# EAGLE schematic BPM (EAGLE 8.1.0)

## Sheet 1 of 5
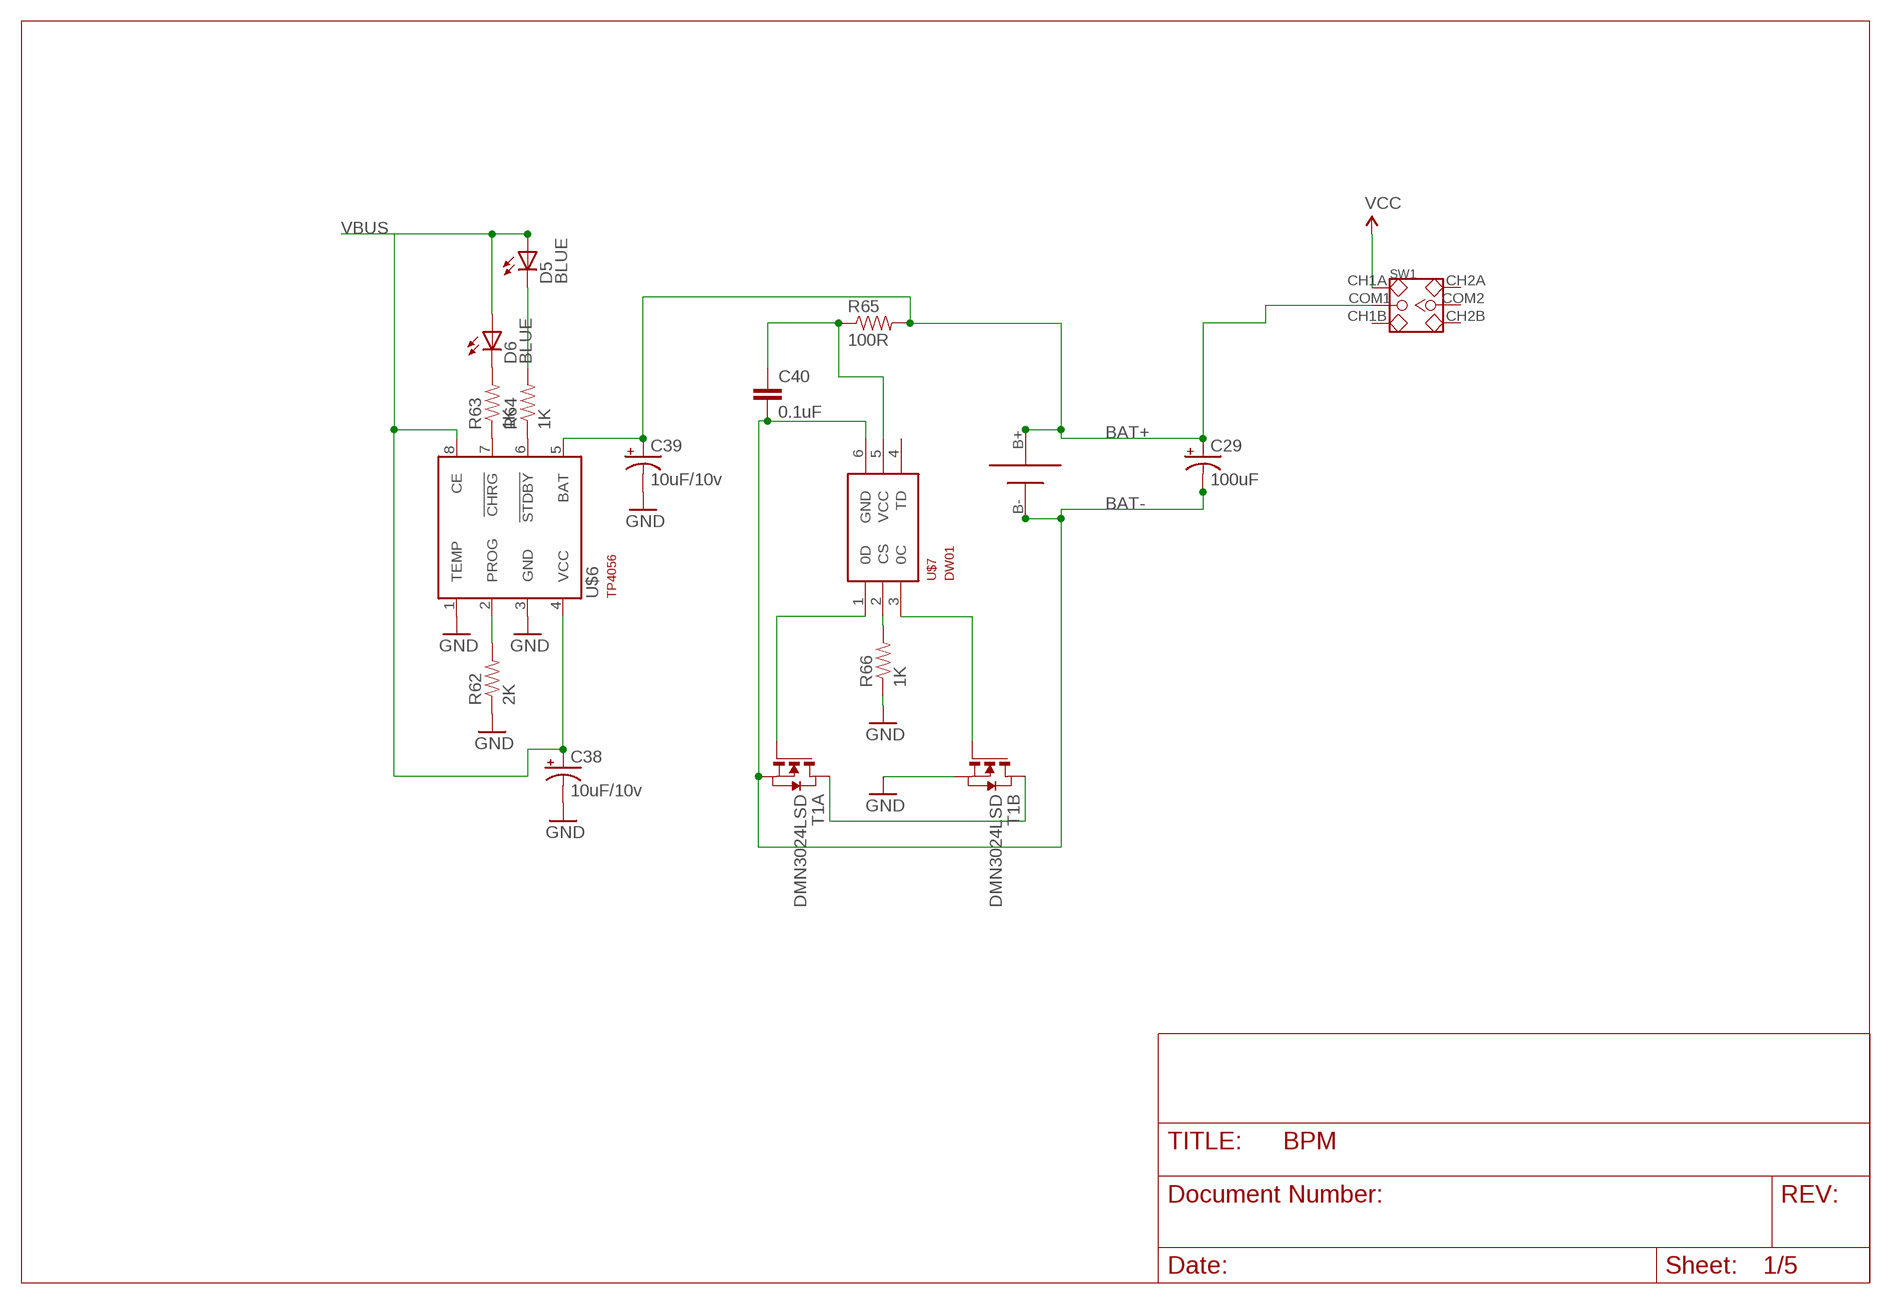
[diagram p0: schematic, sheet 1]

### Parts
C29  100uF  CAP_POLF80  [NIPPON_F80]
C38  10uF/10v  CAP_POL1206-KIT  [EIA3216-KIT]
C39  10uF/10v  CAP_POL1206-KIT  [EIA3216-KIT]
C40  0.1uF  0.1UF-100V-10%(0603)  [0603-CAP]
D5  BLUE  LED-BLUE0603  [LED-0603]
D6  BLUE  LED-BLUE0603  [LED-0603]
R62  2K  1KOHM1/10W1%(0603)  [0603-RES]
R63  1K  1KOHM1/10W1%(0603)  [0603-RES]
R64  1K  1KOHM1/10W1%(0603)  [0603-RES]
R65  100R  1KOHM1/10W1%(0603)  [0603-RES]
R66  1K  1KOHM1/10W1%(0603)  [0603-RES]
SW1  SMD-TOGGLE-SWITCH-2CH(2X3P-7X3.5MM)  [SW6-2.54-SMD-7.0X3.5X1.5MM]
T1  DMN3024LSD  [TSSOP-8]
U$4  18650SMD  [18650SMD]
U$6  TP4056  [SOT23-8]
U$7  DW01  [SOT23-6]

### Nets
BAT+: C29.+ C39.A(+) R65.2 SW1.COM1 U$4.B+ U$6.5(BAT) ; also sheet 4
BAT-: C29.- C40.2 T1.2(A:S) T1.3(A:S) U$4.B- U$7.6(GND) ; also sheet 4
GND: C38.C(-) C39.C(-) R62.1 R66.1 T1.6(B:S) T1.7(B:S) U$6.1(TEMP) U$6.3(GND) ; also sheet 2,3,4,5
N$58: R62.2 U$6.2(PROG)
N$59: R63.1 U$6.7(!CHRG)
N$60: R64.1 U$6.6(!STDBY)
N$61: D6.C R63.2
N$62: D5.C R64.2
N$65: C40.1 R65.1 U$7.5(VCC)
N$67: T1.4(A:G) U$7.1(0D)
N$68: R66.2 U$7.2(CS)
N$69: T1.1(A:D) T1.8(B:D)
N$70: T1.5(B:G) U$7.3(0C)
VBUS: C38.A(+) D5.A D6.A U$6.4(VCC) U$6.8(CE) ; also sheet 2
VCC: SW1.CH1A ; also sheet 2,3,4,5
Unconnected: SW1.CH1B SW1.CH2A SW1.CH2B SW1.COM2 U$7.4(TD)

## Sheet 2 of 5
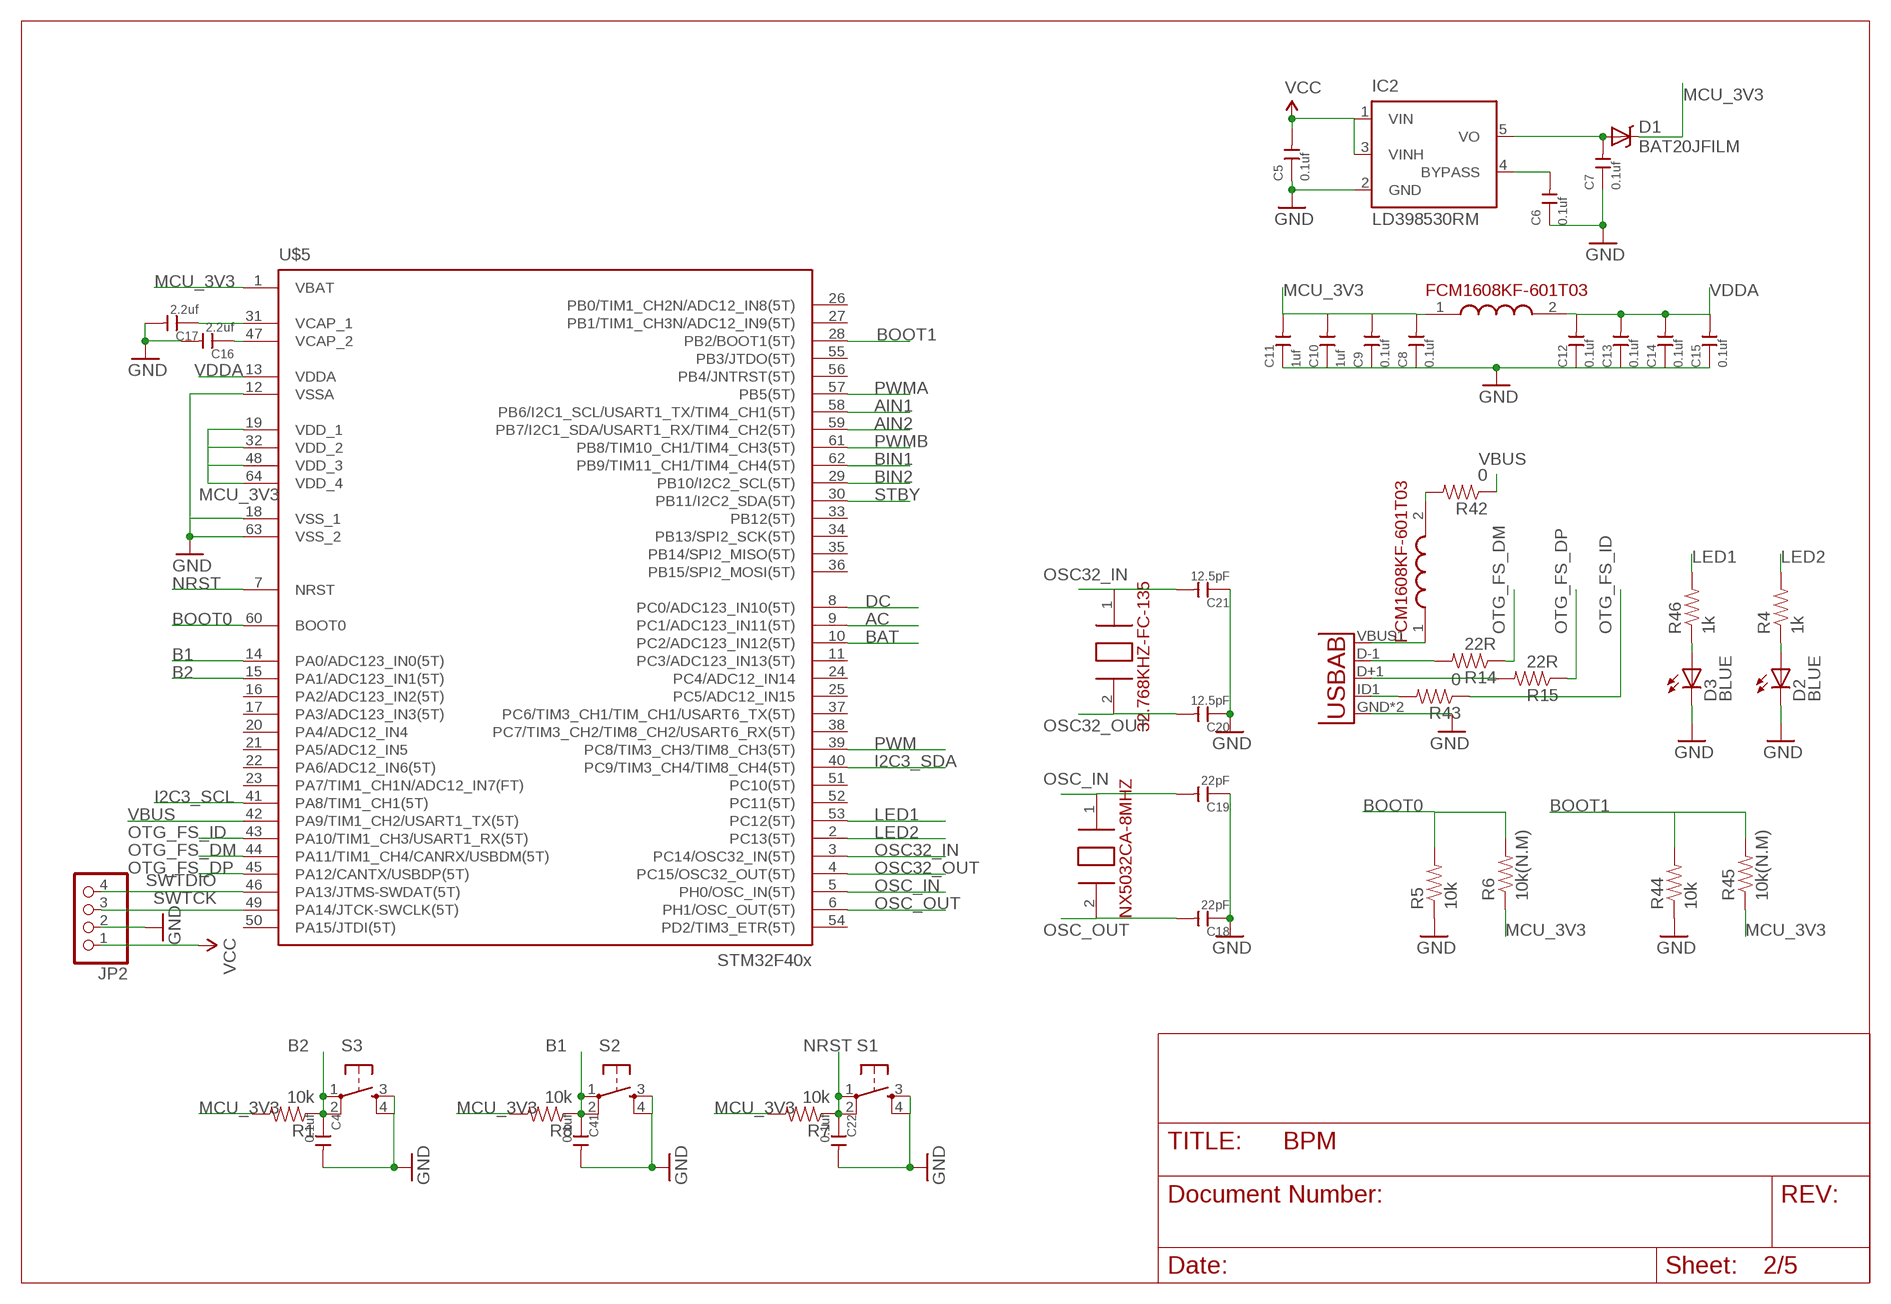
[diagram p1: schematic, sheet 2]

### Parts
C4  0.1uf  CERAMIC-4.7UF-10V-10%-X5R(0603)  [C0603]
C5  0.1uf  CERAMIC-4.7UF-10V-10%-X5R(0603)  [C0603]
C6  0.1uf  CERAMIC-4.7UF-10V-10%-X5R(0603)  [C0603]
C7  0.1uf  CERAMIC-4.7UF-10V-10%-X5R(0603)  [C0603]
C8  0.1uf  CERAMIC-4.7UF-10V-10%-X5R(0603)  [C0603]
C9  0.1uf  CERAMIC-4.7UF-10V-10%-X5R(0603)  [C0603]
C10  1uf  CERAMIC-4.7UF-10V-10%-X5R(0603)  [C0603]
C11  1uf  CERAMIC-4.7UF-10V-10%-X5R(0603)  [C0603]
C12  0.1uf  CERAMIC-4.7UF-10V-10%-X5R(0603)  [C0603]
C13  0.1uf  CERAMIC-4.7UF-10V-10%-X5R(0603)  [C0603]
C14  0.1uf  CERAMIC-4.7UF-10V-10%-X5R(0603)  [C0603]
C15  0.1uf  CERAMIC-4.7UF-10V-10%-X5R(0603)  [C0603]
C16  2.2uf  CERAMIC-4.7UF-10V-10%-X5R(0603)  [C0603]
C17  2.2uf  CERAMIC-4.7UF-10V-10%-X5R(0603)  [C0603]
C18  22pF  CERAMIC-4.7UF-10V-10%-X5R(0603)  [C0603]
C19  22pF  CERAMIC-4.7UF-10V-10%-X5R(0603)  [C0603]
C20  12.5pF  CERAMIC-4.7UF-10V-10%-X5R(0603)  [C0603]
C21  12.5pF  CERAMIC-4.7UF-10V-10%-X5R(0603)  [C0603]
C22  0.1uf  CERAMIC-4.7UF-10V-10%-X5R(0603)  [C0603]
C41  0.1uf  CERAMIC-4.7UF-10V-10%-X5R(0603)  [C0603]
D1  BAT20JFILM  [SOD-323]
D2  BLUE  LED-BLUE0603  [LED-0603]
D3  BLUE  LED-BLUE0603  [LED-0603]
IC2  LD398530RM  [SOT23-5L]
JP2  PINHD-1X4  [1X04]
R1  10k  0OHM1/10W5%(0603)  [0603]
R4  1k  0OHM1/10W5%(0603)  [0603]
R5  10k  0OHM1/10W5%(0603)  [0603]
R6  10k(N.M)  0OHM1/10W5%(0603)  [0603]
R7  10k  0OHM1/10W5%(0603)  [0603]
R8  10k  0OHM1/10W5%(0603)  [0603]
R14  22R  390OHM1/10W1%(0603)  [0603-RES]
R15  22R  390OHM1/10W1%(0603)  [0603-RES]
R42  0  390OHM1/10W1%(0603)  [0603-RES]
R43  0  390OHM1/10W1%(0603)  [0603-RES]
R44  10k  0OHM1/10W5%(0603)  [0603]
R45  10k(N.M)  0OHM1/10W5%(0603)  [0603]
R46  1k  0OHM1/10W5%(0603)  [0603]
S1  TAC_SWITCHSMD  [TACTILE_SWITCH_SMD]
S2  TAC_SWITCHSMD  [TACTILE_SWITCH_SMD]
S3  TAC_SWITCHSMD  [TACTILE_SWITCH_SMD]
U1  USB""  [USB-MICRO-SMD]
U$5  STM32F405R  [TQFP64]
U$8  32.768KHZ-FC-135  [32.768KHZ-FC-135]
U$9  NX5032CA-8MHZ  [NX5032CA-8MHZ]
U$10  FCM1608KF-601T03  [FCM1608KF-601T03]
U$15  FCM1608KF-601T03  [FCM1608KF-601T03]

### Nets
AC: U$5.9(PC1/ADC123_IN11(5T)) ; also sheet 3
AIN1: U$5.58(PB6/I2C1_SCL/USART1_TX/TIM4_CH1(5T)) ; also sheet 4
AIN2: U$5.59(PB7/I2C1_SDA/USART1_RX/TIM4_CH2(5T)) ; also sheet 4
B1: C41.1 R8.1 S2.1 S2.2 U$5.14(PA0/ADC123_IN0(5T))
B2: C4.1 R1.1 S3.1 S3.2 U$5.15(PA1/ADC123_IN1(5T))
BAT: U$5.10(PC2/ADC123_IN12(5T)) ; also sheet 3
BIN1: U$5.62(PB9/TIM11_CH1/TIM4_CH4(5T)) ; also sheet 4
BIN2: U$5.29(PB10/I2C2_SCL(5T)) ; also sheet 4
BOOT0: R5.2 R6.2 U$5.60(BOOT0)
BOOT1: R44.2 R45.2 U$5.28(PB2/BOOT1(5T))
DC: U$5.8(PC0/ADC123_IN10(5T)) ; also sheet 3
GND: C4.2 C5.1 C6.1 C7.1 C8.1 C9.1 C10.1 C11.1 C12.1 C13.1 C14.1 C15.1 C16.2 C17.2 C18.1 C19.1 C20.1 C21.1 C22.2 C41.2 D2.C D3.C IC2.2(GND) JP2.2 R5.1 R44.1 S1.3 S1.4 S2.3 S2.4 S3.3 S3.4 U1.GND U1.GND1(GND) U$5.12(VSSA) U$5.18(VSS_1) U$5.63(VSS_2) ; also sheet 1,3,4,5
I2C3_SCL: U$5.41(PA8/TIM1_CH1(5T)) ; also sheet 5
I2C3_SDA: U$5.40(PC9/TIM3_CH4/TIM8_CH4(5T)) ; also sheet 5
LED1: R46.2 U$5.53(PC12(5T))
LED2: R4.2 U$5.2(PC13(5T))
MCU_3V3: C8.2 C9.2 C10.2 C11.2 D1.1(C) R1.2 R6.1 R7.2 R8.2 R45.1 U$5.1(VBAT) U$5.19(VDD_1) U$5.32(VDD_2) U$5.48(VDD_3) U$5.64(VDD_4) U$10.1(1.IN) ; also sheet 3,4,5
N$2: D2.A R4.1
N$3: C17.1 U$5.31(VCAP_1)
N$5: C16.1 U$5.47(VCAP_2)
N$6: C6.2 IC2.4(BYPASS)
N$7: C7.2 D1.2(A) IC2.5(VO)
N$13: R14.2 U1.D-1(D-)
N$23: R15.2 U1.D+1(D+)
N$45: R43.2 U1.ID1(USBID)
N$46: U1.VBUS1(VBUS) U$15.1(1.IN)
N$47: R42.2 U$15.2(2.OUT)
N$48: D3.A R46.1
NRST: C22.1 R7.1 S1.1 S1.2 U$5.7(NRST)
OSC32_IN: C21.2 U$5.3(PC14/OSC32_IN(5T)) U$8.1(1.XIN)
OSC32_OUT: C20.2 U$5.4(PC15/OSC32_OUT(5T)) U$8.2(2.XIN)
OSC_IN: C19.2 U$5.5(PH0/OSC_IN(5T)) U$9.1(1.XIN)
OSC_OUT: C18.2 U$5.6(PH1/OSC_OUT(5T)) U$9.2(2.XOUT)
OTG_FS_DM: R14.1 U$5.44(PA11/TIM1_CH4/CANRX/USBDM(5T))
OTG_FS_DP: R15.1 U$5.45(PA12/CANTX/USBDP(5T))
OTG_FS_ID: R43.1 U$5.43(PA10/TIM1_CH3/USART1_RX(5T))
PWM: U$5.39(PC8/TIM3_CH3/TIM8_CH3(5T)) ; also sheet 3
PWMA: U$5.57(PB5(5T)) ; also sheet 4
PWMB: U$5.61(PB8/TIM10_CH1/TIM4_CH3(5T)) ; also sheet 4
STBY: U$5.30(PB11/I2C2_SDA(5T)) ; also sheet 4
SWTCK: JP2.3 U$5.49(PA14/JTCK-SWCLK(5T))
SWTDIO: JP2.4 U$5.46(PA13/JTMS-SWDAT(5T))
VBUS: R42.1 U$5.42(PA9/TIM1_CH2/USART1_TX(5T)) ; also sheet 1
VCC: C5.2 IC2.1(VIN) IC2.3(VINH) JP2.1 ; also sheet 1,3,4,5
VDDA: C12.2 C13.2 C14.2 C15.2 U$5.13(VDDA) U$10.2(2.OUT)
Unconnected: U$5.11(PC3/ADC123_IN13(5T)) U$5.16(PA2/ADC123_IN2(5T)) U$5.17(PA3/ADC123_IN3(5T)) U$5.20(PA4/ADC12_IN4) U$5.21(PA5/ADC12_IN5) U$5.22(PA6/ADC12_IN6(5T)) U$5.23(PA7/TIM1_CH1N/ADC12_IN7(FT)) U$5.24(PC4/ADC12_IN14) U$5.25(PC5/ADC12_IN15) U$5.26(PB0/TIM1_CH2N/ADC12_IN8(5T)) U$5.27(PB1/TIM1_CH3N/ADC12_IN9(5T)) U$5.33(PB12(5T)) U$5.34(PB13/SPI2_SCK(5T)) U$5.35(PB14/SPI2_MISO(5T)) U$5.36(PB15/SPI2_MOSI(5T)) U$5.37(PC6/TIM3_CH1/TIM_CH1/USART6_TX(5T)) U$5.38(PC7/TIM3_CH2/TIM8_CH2/USART6_RX(5T)) U$5.50(PA15/JTDI(5T)) U$5.51(PC10(5T)) U$5.52(PC11(5T)) U$5.54(PD2/TIM3_ETR(5T)) U$5.55(PB3/JTDO(5T)) U$5.56(PB4/JNTRST(5T))

## Sheet 3 of 5
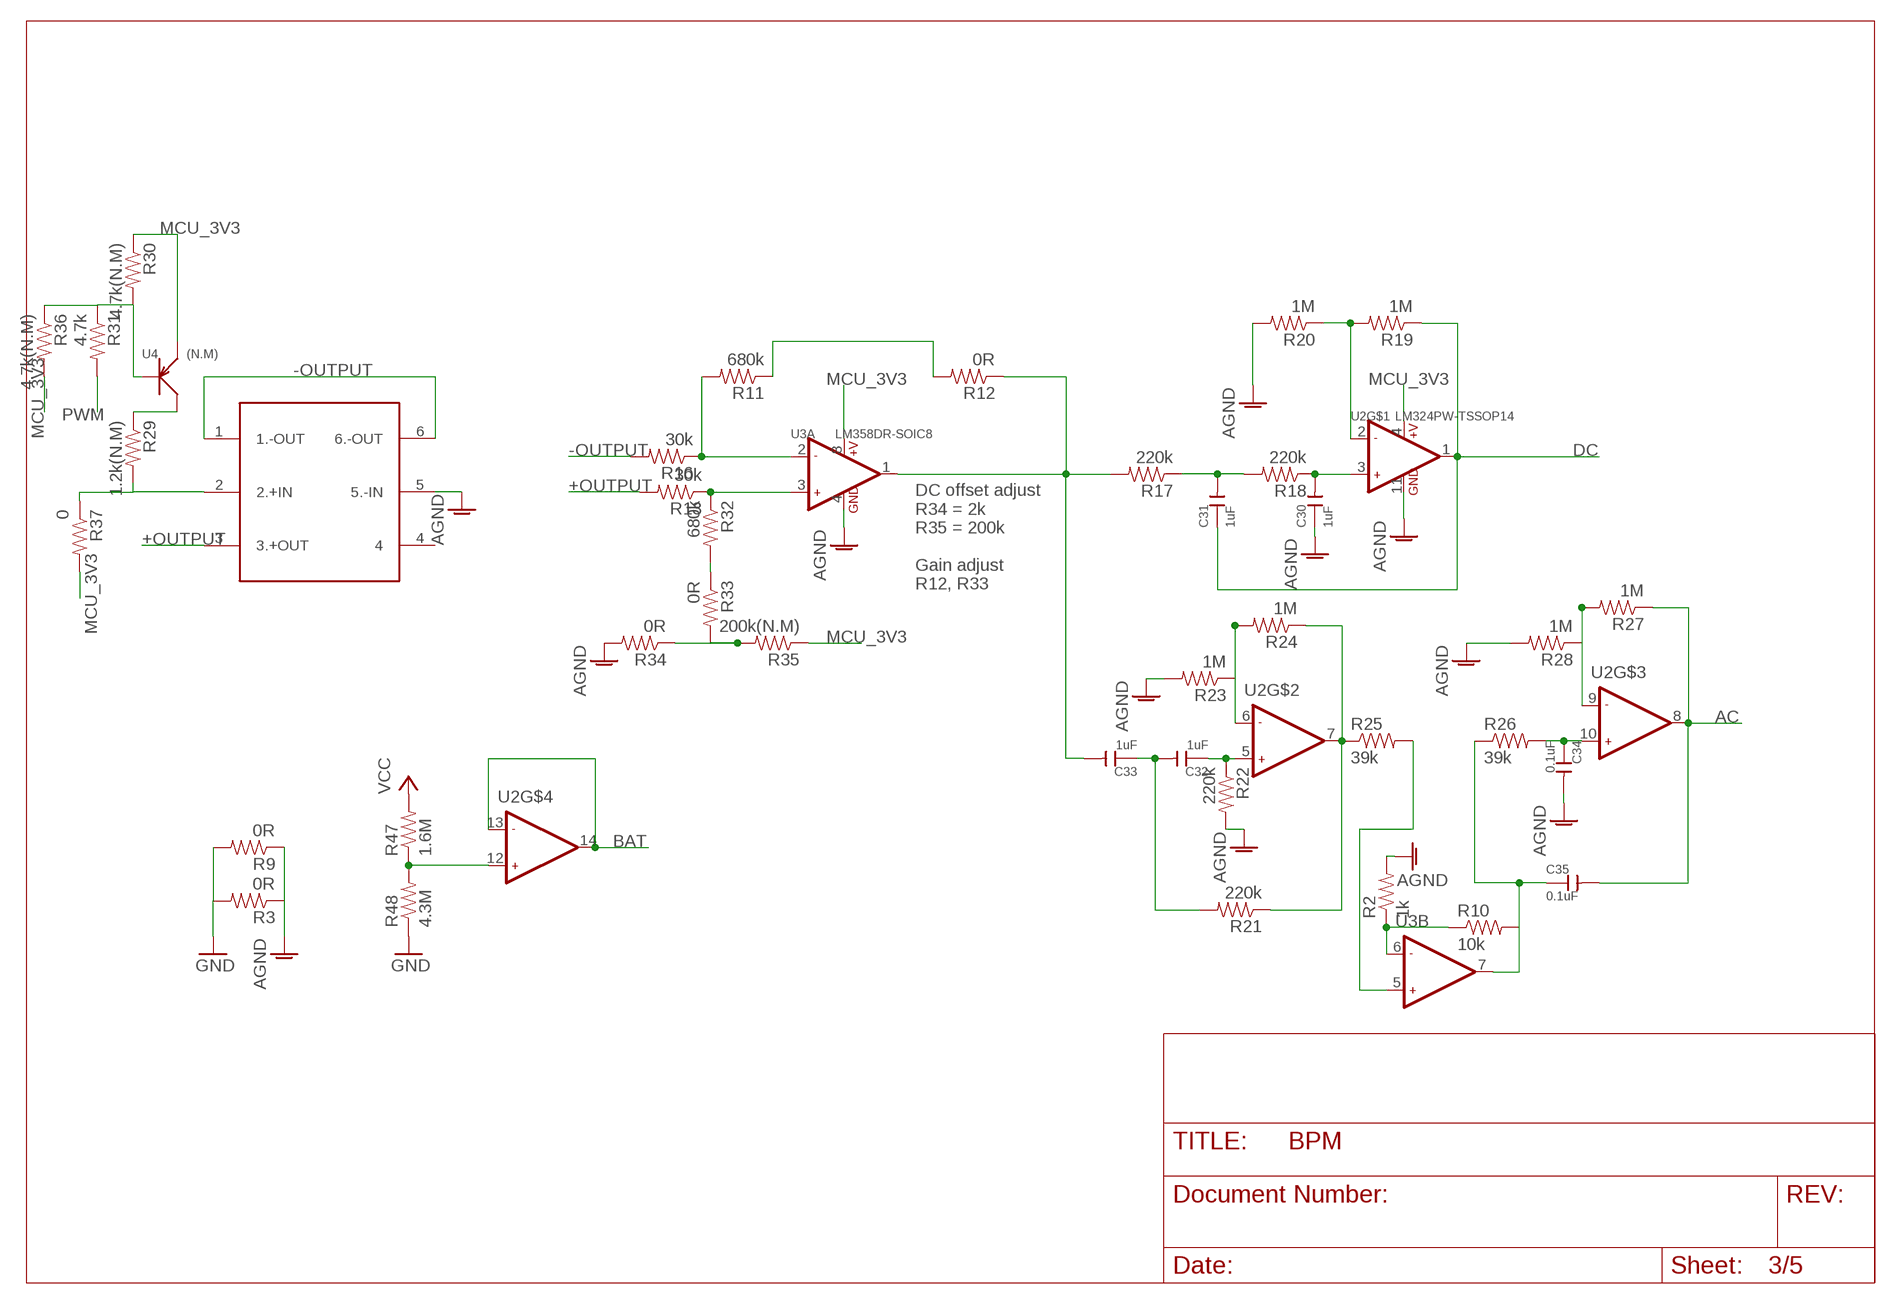
[diagram p2: schematic, sheet 3]

### Parts
C30  1uF  CERAMIC-4.7UF-10V-10%-X5R(0603)  [C0603]
C31  1uF  CERAMIC-4.7UF-10V-10%-X5R(0603)  [C0603]
C32  1uF  CERAMIC-4.7UF-10V-10%-X5R(0603)  [C0603]
C33  1uF  CERAMIC-4.7UF-10V-10%-X5R(0603)  [C0603]
C34  0.1uF  CERAMIC-4.7UF-10V-10%-X5R(0603)  [C0603]
C35  0.1uF  CERAMIC-4.7UF-10V-10%-X5R(0603)  [C0603]
R2  1k  0OHM1/10W5%(0603)  [0603]
R3  0R  0OHM1/10W5%(0603)  [0603]
R9  0R  0OHM1/10W5%(0603)  [0603]
R10  10k  0OHM1/10W5%(0603)  [0603]
R11  680k  0OHM1/10W5%(0603)  [0603]
R12  0R  0OHM1/10W5%(0603)  [0603]
R13  30k  0OHM1/10W5%(0603)  [0603]
R16  30k  0OHM1/10W5%(0603)  [0603]
R17  220k  0OHM1/10W5%(0603)  [0603]
R18  220k  0OHM1/10W5%(0603)  [0603]
R19  1M  0OHM1/10W5%(0603)  [0603]
R20  1M  0OHM1/10W5%(0603)  [0603]
R21  220k  0OHM1/10W5%(0603)  [0603]
R22  220k  0OHM1/10W5%(0603)  [0603]
R23  1M  0OHM1/10W5%(0603)  [0603]
R24  1M  0OHM1/10W5%(0603)  [0603]
R25  39k  0OHM1/10W5%(0603)  [0603]
R26  39k  0OHM1/10W5%(0603)  [0603]
R27  1M  0OHM1/10W5%(0603)  [0603]
R28  1M  0OHM1/10W5%(0603)  [0603]
R29  1.2k(N.M)  0OHM1/10W5%(0603)  [0603]
R30  4.7k(N.M)  0OHM1/10W5%(0603)  [0603]
R31  4.7k  0OHM1/10W5%(0603)  [0603]
R32  680k  0OHM1/10W5%(0603)  [0603]
R33  0R  0OHM1/10W5%(0603)  [0603]
R34  0R  0OHM1/10W5%(0603)  [0603]
R35  200k(N.M)  0OHM1/10W5%(0603)  [0603]
R36  4.7k(N.M)  0OHM1/10W5%(0603)  [0603]
R37  0  0OHM1/10W5%(0603)  [0603]
R47  1.6M  0OHM1/10W5%(0603)  [0603]
R48  4.3M  0OHM1/10W5%(0603)  [0603]
U2  LM324PW-TSSOP14  AMPLIFIER-LM324PW(TSSOP14)  [TSSOP14-0.65-5X4.4MM]
U3  LM358DR-SOIC8  AMPLIFIER-LM358DR(SOIC8)  [SOIC8-1.27-5X4MM]
U4  (N.M)  TRANSISTOR-PNP  [SOT-23]
U$1  MPS-3117-006G  [MPS-3117-006G]

### Nets
+OUTPUT: R13.2 U$1.3(3.+OUT)
-OUTPUT: R16.2 U$1.1(1.-OUT) U$1.6(6.-OUT)
AC: C35.2 R27.1 U2.8(OUT2) ; also sheet 2
AGND: C30.1 C34.2 R2.2 R3.1 R9.1 R20.2 R22.2 R23.2 R28.2 R34.2 U2.11(GND) U3.4(A:GND) U$1.5(5.-IN)
BAT: U2.13(-IN2) U2.14(OUT2) ; also sheet 2
DC: C31.1 R19.1 U2.1(OUT1) ; also sheet 2
GND: R3.2 R9.2 R48.1 ; also sheet 1,2,4,5
MCU_3V3: R30.1 R35.1 R36.2 R37.2 U2.4(+V) U3.8(A:+V) U4.2(E) ; also sheet 2,4,5
N$1: C35.1 R10.2 R26.1 U3.7(B:OUT2)
N$8: R25.2 U3.5(B:+IN2)
N$9: R47.1 R48.2 U2.12(+IN2)
N$14: R2.1 R10.1 U3.6(B:-IN2)
N$19: R11.1 R12.2
N$20: R11.2 R16.1 U3.2(A:-IN1)
N$21: C33.2 R12.1 R17.2 U3.1(A:OUT1)
N$22: R13.1 R32.1 U3.3(A:+IN1)
N$24: R29.2 R37.1 U$1.2(2.+IN)
N$25: C31.2 R17.1 R18.2
N$26: C30.2 R18.1 U2.3(+IN1)
N$27: C32.1 R22.1 U2.5(+IN2)
N$28: R19.2 R20.1 U2.2(-IN1)
N$29: C32.2 C33.1 R21.2
N$30: R21.1 R24.1 R25.1 U2.7(OUT2)
N$31: R23.1 R24.2 U2.6(-IN2)
N$32: R29.1 U4.3(C)
N$33: C34.1 R26.2 U2.10(+IN2)
N$34: R32.2 R33.1
N$35: R27.2 R28.1 U2.9(-IN2)
N$36: R30.2 R31.1 R36.1 U4.1(B)
N$37: R33.2 R34.1 R35.2
PWM: R31.2 ; also sheet 2
VCC: R47.2 ; also sheet 1,2,4,5
Unconnected: U$1.4

### Notes on the sheet
- DC offset adjust
  R34 = 2k
  R35 = 200k
  
  Gain adjust
  R12, R33

## Sheet 4 of 5
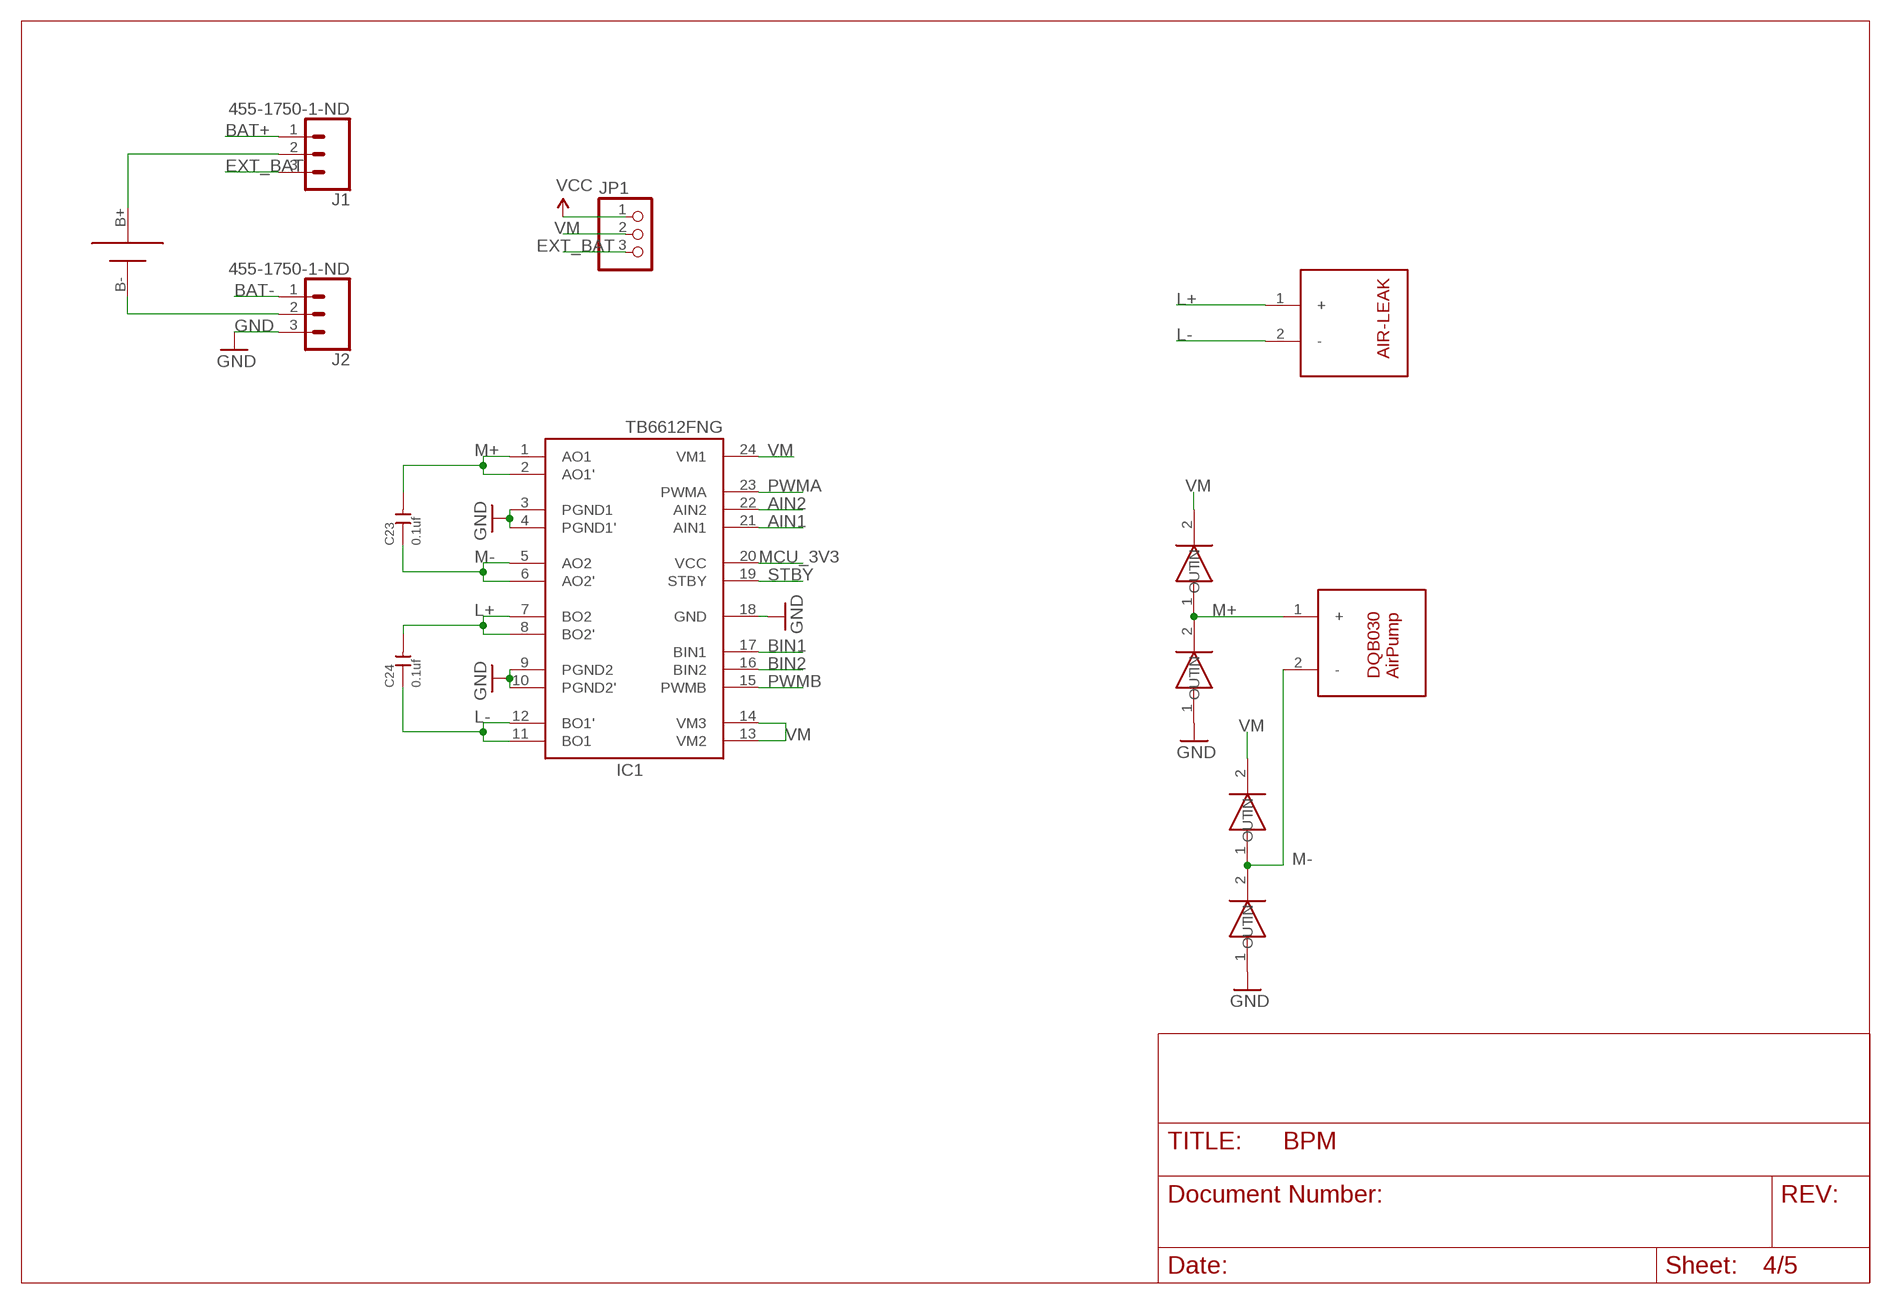
[diagram p3: schematic, sheet 4]

### Parts
C23  0.1uf  CERAMIC-4.7UF-10V-10%-X5R(0603)  [C0603]
C24  0.1uf  CERAMIC-4.7UF-10V-10%-X5R(0603)  [C0603]
IC1  TB6612FNG  [SSOP24]
J1  455-1750-1-ND  CONN_03  [1X03]
J2  455-1750-1-ND  CONN_03  [1X03]
JP1  PINHD-1X3  [1X03]
U$11  AIR-LEAK  [AIR-LEAK]
U$12  DQB030-AIRPUMP  [DQB030-AIRPUMP]
U$13  SMA-SS34  [SMA-SS34]
U$14  SMA-SS34  [SMA-SS34]
U$16  SMA-SS34  [SMA-SS34]
U$17  SMA-SS34  [SMA-SS34]
U$19  18650SMD  [18650SMD]

### Nets
AIN1: IC1.21(AIN1) ; also sheet 2
AIN2: IC1.22(AIN2) ; also sheet 2
BAT+: J1.1 ; also sheet 1
BAT-: J2.1 ; also sheet 1
BIN1: IC1.17(BIN1) ; also sheet 2
BIN2: IC1.16(BIN2) ; also sheet 2
EXT_BAT: J1.3 JP1.3
GND: IC1.3(PGND1) IC1.4(PGND1') IC1.9(PGND2) IC1.10(PGND2') IC1.18(GND) J2.3 U$14.1(IN) U$17.1(IN) ; also sheet 1,2,3,5
L+: C24.2 IC1.7(BO2) IC1.8(BO2') U$11.1(+)
L-: C24.1 IC1.11(BO1) IC1.12(BO1') U$11.2(-)
M+: C23.2 IC1.1(AO1) IC1.2(AO1') U$12.1(+) U$13.1(IN) U$14.2(OUT)
M-: C23.1 IC1.5(AO2) IC1.6(AO2') U$12.2(-) U$16.1(IN) U$17.2(OUT)
MCU_3V3: IC1.20(VCC) ; also sheet 2,3,5
N$4: J1.2 U$19.B+
N$10: J2.2 U$19.B-
PWMA: IC1.23(PWMA) ; also sheet 2
PWMB: IC1.15(PWMB) ; also sheet 2
STBY: IC1.19(STBY) ; also sheet 2
VCC: JP1.1 ; also sheet 1,2,3,5
VM: IC1.13(VM2) IC1.14(VM3) IC1.24(VM1) JP1.2 U$13.2(OUT) U$16.2(OUT)

## Sheet 5 of 5
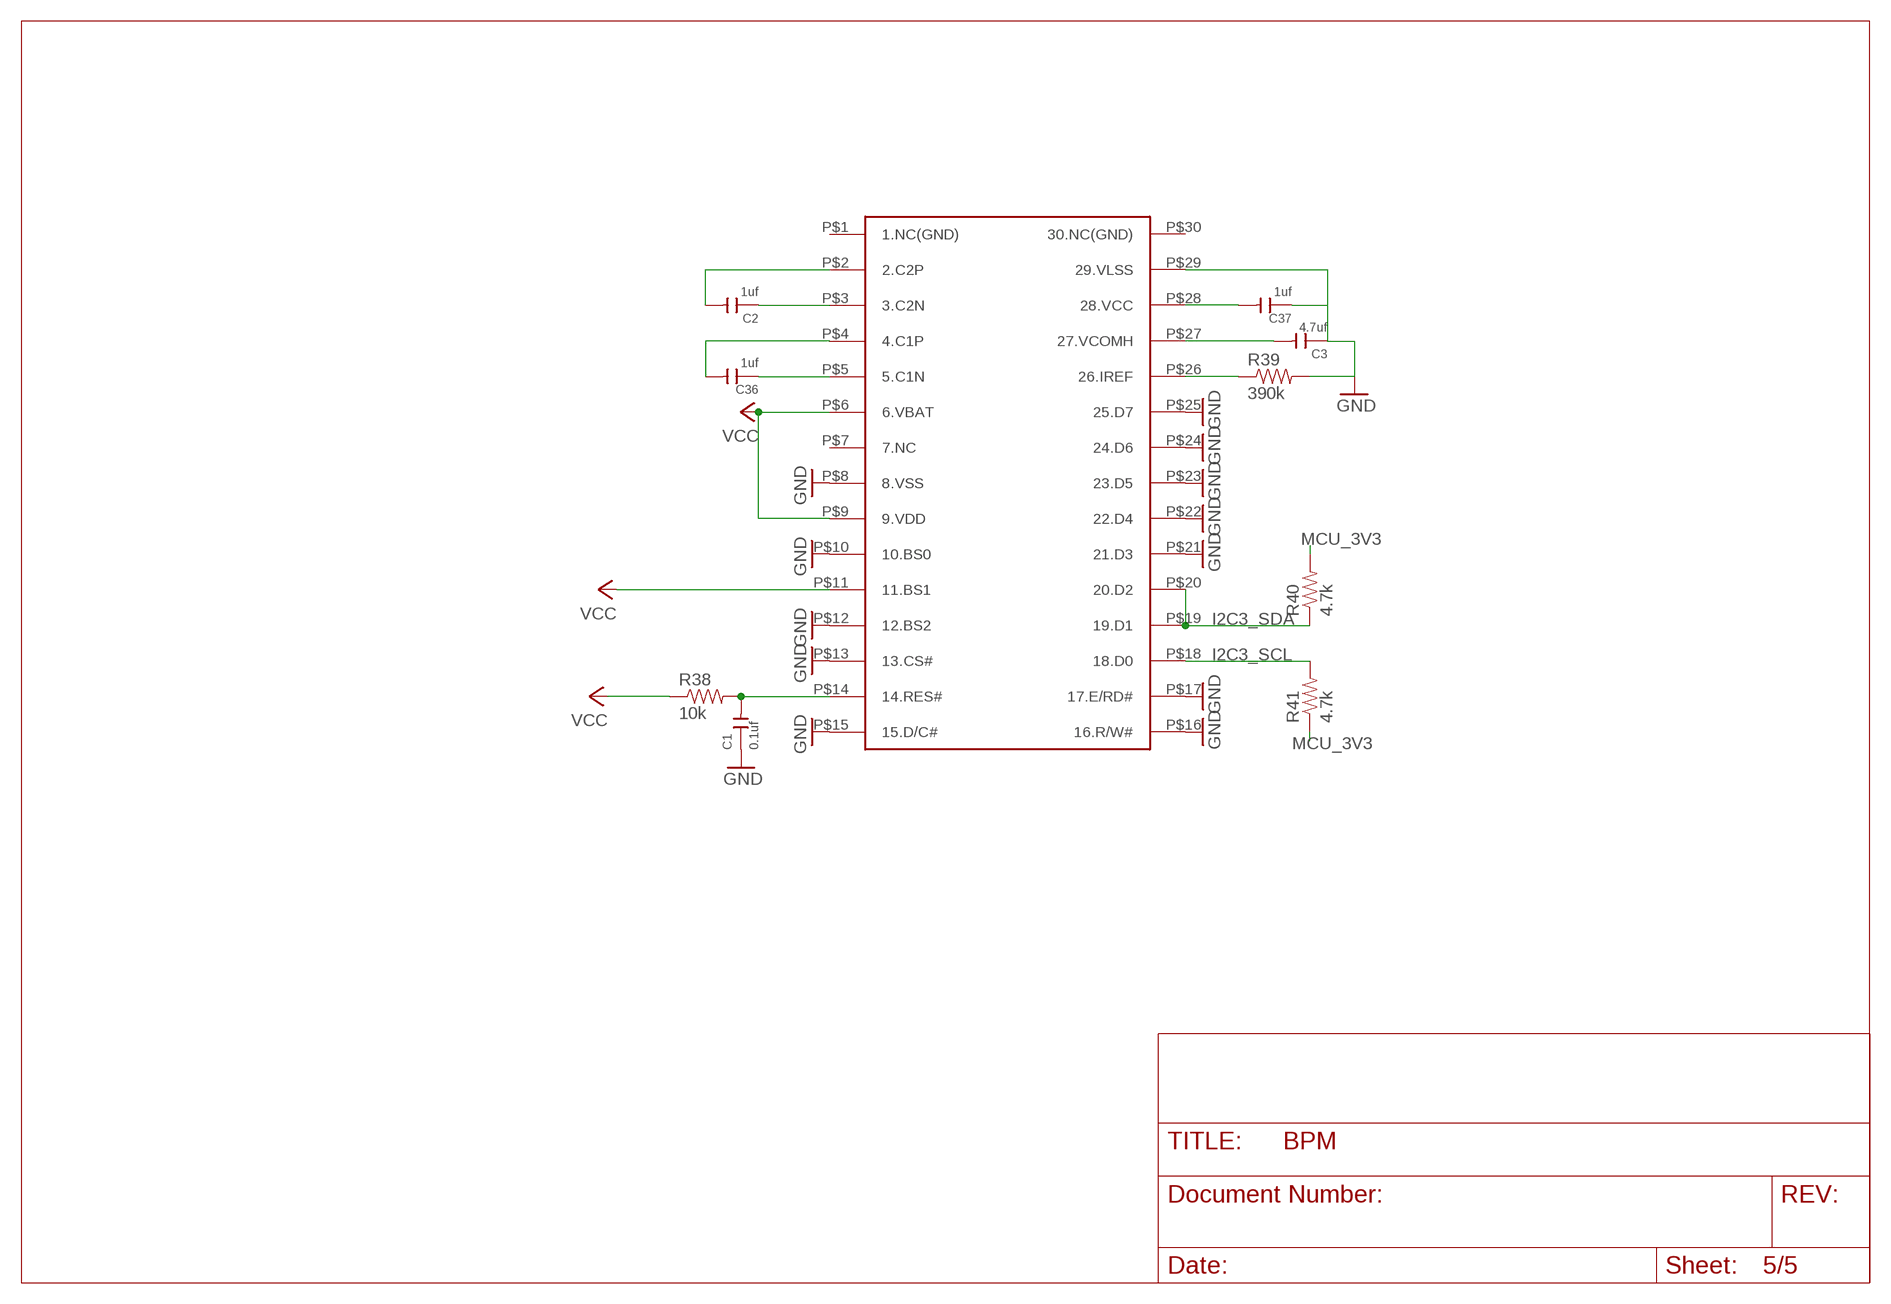
[diagram p4: schematic, sheet 5]

### Parts
C1  0.1uf  CERAMIC-4.7UF-10V-10%-X5R(0603)  [C0603]
C2  1uf  CERAMIC-4.7UF-10V-10%-X5R(0603)  [C0603]
C3  4.7uf  CERAMIC-4.7UF-10V-10%-X5R(0603)  [C0603]
C36  1uf  CERAMIC-4.7UF-10V-10%-X5R(0603)  [C0603]
C37  1uf  CERAMIC-4.7UF-10V-10%-X5R(0603)  [C0603]
R38  10k  0OHM1/10W5%(0603)  [0603]
R39  390k  0OHM1/10W5%(0603)  [0603]
R40  4.7k  0OHM1/10W5%(0603)  [0603]
R41  4.7k  0OHM1/10W5%(0603)  [0603]
U$18  ER-OLED0.96  [ER-OLED0.96]

### Nets
GND: C1.1 C3.1 C37.1 R39.2 U$18.P$8(8.VSS) U$18.P$10(10.BS0) U$18.P$12(12.BS2) U$18.P$13(13.CS#) U$18.P$15(15.D/C#) U$18.P$16(16.R/W#) U$18.P$17(17.E/RD#) U$18.P$21(21.D3) U$18.P$22(22.D4) U$18.P$23(23.D5) U$18.P$24(24.D6) U$18.P$25(25.D7) U$18.P$29(29.VLSS) ; also sheet 1,2,3,4
I2C3_SCL: R41.2 U$18.P$18(18.D0) ; also sheet 2
I2C3_SDA: R40.1 U$18.P$19(19.D1) U$18.P$20(20.D2) ; also sheet 2
MCU_3V3: R40.2 R41.1 ; also sheet 2,3,4
N$11: C1.2 R38.2 U$18.P$14(14.RES#)
N$12: C2.1 U$18.P$3(3.C2N)
N$39: C36.1 U$18.P$5(5.C1N)
N$40: C2.2 U$18.P$2(2.C2P)
N$41: C36.2 U$18.P$4(4.C1P)
N$42: R39.1 U$18.P$26(26.IREF)
N$43: C3.2 U$18.P$27(27.VCOMH)
N$44: C37.2 U$18.P$28(28.VCC)
VCC: R38.1 U$18.P$6(6.VBAT) U$18.P$9(9.VDD) U$18.P$11(11.BS1) ; also sheet 1,2,3,4
Unconnected: U$18.P$1(1.NC(GND)) U$18.P$7(7.NC) U$18.P$30(30.NC(GND))

## Library data of the parts
C1 C2 C4-C24 C30-C37 C41 = Seeed-OPL-Capacitor:CERAMIC-4.7UF-10V-10%-X5R(0603): 302010111; MPN: CC0603KRX5R6BB475; VALUE: 4.7uf
C3 = Seeed-OPL-Capacitor:CERAMIC-4.7UF-10V-10%-X5R(0603): 302010111; MPN: CC0603KRX5R6BB475
C29 C38 C39 = SparkFun-Capacitors:CAP_POL: Capacitor Polarized These are standard SMD and PTH capacitors. Normally 10uF, 47uF, and 100uF in electrolytic and tantalum varieties. Always verify the external diameter of the through hole cap, it varies with capacity, voltage, and manufacturer. The EIA devices should be standard.
C40 = SparkFun-Capacitors:0.1UF-100V-10%(0603): CAP-08390; PROD_ID: CAP-08390
D1 = SparkFun-DiscreteSemi:BAT20JFILM: 23V, 1A Schottky diode, SOD-323 package; PROD_ID: DIO-11623
D2 D3 D5 D6 = SparkFun-LED:LED-BLUE: Blue LEDs for production use Various blue LEDs stocked by SparkFun production 0603 - DIO-08575 Rebel - DIO-09553 1206 - DIO-09911; PROD_ID: DIO-08575
IC1 = adafruit:TB6612FNG: TB6612FNG MOS dual H-bridge motor driver, 1.2A current 3.2A peak 3 or 5v logic and 3-15v motor
IC2 = st-microelectronics:LD3985: Ultra low drop and low noise BiCMOS voltage regulators Source: www.st.com LD3985.pdf
J1 J2 = SparkFun-Connectors:CONN_03: Multi connection point. Often used as Generic Header-pin footprint for 0.1 inch spaced/style header connections On any of the 0.1 inch spaced packages, you can populate with these: Break Away Headers - Straight <https://www.sparkfun.com/products/116> (PRT-00116) Break Away Male Headers - Right Angle <https://www.sparkfun.com/products/553> (PRT-00553) Female Headers <https://www.sparkfun.com/products/115> (PRT-00115) Break Away Headers - Machine Pin <https://www.sparkfun.com/products/117> (PRT-00117) Break Away Female Headers - Swiss Machine Pin <https://www.sparkfun.com/products/743> (PRT-00743) Stackable Header - 3 Pin (Female, 0.1") <https://www.sparkfun.com/products/13875> (PRT-13875) For SCREWTERMINALS and SPRING TERMINALS visit here: Screw Terimnals on SparkFun.com <https://www.sparkfun.com/search/results?term=Screw+Terminals> (5mm/3.5mm/2.54mm spacing) This device is also useful as a general connection point to wire up your design to another part of your project. Our various solder wires solder well into these plated through hole pads. Hook-Up Wire - Assortment (Stranded, 22 AWG) <https://www.sparkfun.com/products/11375> (PRT-11375) Hook-Up Wire - Assortment (Solid Core, 22 AWG) <https://www.sparkfun.com/products/11367> (PRT-11367) View the entire wire category on our website here <https://www.sparkfun.com/categories/141> Special notes: Molex polarized connector foot print use with SKU : PRT-08232 with associated crimp pins and housings.; PROD_ID: XXX-00000
JP1 = adafruit:PINHD-1X3: PIN HEADER
JP2 = pinhead:PINHD-1X4: PIN HEADER
R1-R13 R16-R36 R38-R41 R44-R48 = SparkFun-Resistors:0OHM1/10W5%(0603): RES-08609; PROD_ID: RES-08609; VALUE: 0
R14 R15 R42 R43 = SparkFun-Resistors:390OHM1/10W1%(0603): RES-07864; PROD_ID: RES-07864; VALUE: 390
R37 = SparkFun-Resistors:0OHM1/10W5%(0603): RES-08609; PROD_ID: RES-08609
R62 R65 = SparkFun-Resistors:1KOHM1/10W1%(0603): RES-07856; PROD_ID: RES-07856; VALUE: 1K
R63 R64 R66 = SparkFun-Resistors:1KOHM1/10W1%(0603): RES-07856; PROD_ID: RES-07856
S1-S3 = SparkFun-Electromechanical:TAC_SWITCH: Momentary Switch Button commonly used for reset or general input. Spark Fun Electronics SKU : COM-00097 SMT- SWCH-08247; PROD_ID: SWCH-08247
SW1 = Seeed-OPL-Switch:SMD-TOGGLE-SWITCH-2CH(2X3P-7X3.5MM): 311030005
T1 = FS8205A:DMN3024LSD: DUAL N-CHANNEL ENHANCEMENT MODE MOSFET data sheet <http://goo.gl/dRgboR> Dave.Calaway Eagle Library <https://goo.gl/Muy1Tr>
U1 = MicroUSB Long GND:USB: This is a USB AB connector that is compatible with USB OTG. i.e. this connector can serve as a host or device
U2 = Seeed-OPL-ic:AMPLIFIER-LM324PW(TSSOP14): 310020008; MPN: LM324PW
U3 = Seeed-OPL-ic:AMPLIFIER-LM358DR(SOIC8): 310020021; MPN: LM358DR
U4 = Seeed-OPL-Transistor:TRANSISTOR-PNP*: S8550：PNP Transistor
U$1 = MPS-3117-006G:MPS-3117-006G
U$4 U$19 = 18650SMD:18650SMD
U$5 = stm32f4:STM32F405R: STM32F405 64 pin LQFP reviewed: YES tested: YES
U$6 = TP4056:TP4056: TP4056 Data sheet <http://goo.gl/J7k8TF> Dave.Calaway Eagle Library <https://goo.gl/Muy1Tr>
U$7 = DW01:DW01: The DW01-P battery protection IC is designed to protect lithium-ion/polymer battery from damage or degrading the lifetime due to overcharge, overdischarge, and/or overcurrent for one-cell lithium-ion/polymer battery powered systems, such as cellular phones. Data sheet <http://goo.gl/4y108d> Dave.Calaway Eagle Library <https://goo.gl/Muy1Tr>
U$8 = 32.768KHZ-FC-135:32.768KHZ-FC-135
U$9 = NX5032CA-8MHZ:NX5032CA-8MHZ
U$10 U$15 = FCM1608KF-601T03:FCM1608KF-601T03
U$11 = AIR-LEAK:AIR-LEAK
U$12 = DQB030-AirPump:DQB030-AIRPUMP
U$13 U$14 U$16 U$17 = SMA-SS34:SMA-SS34
U$18 = ER-OLED0.96:ER-OLED0.96